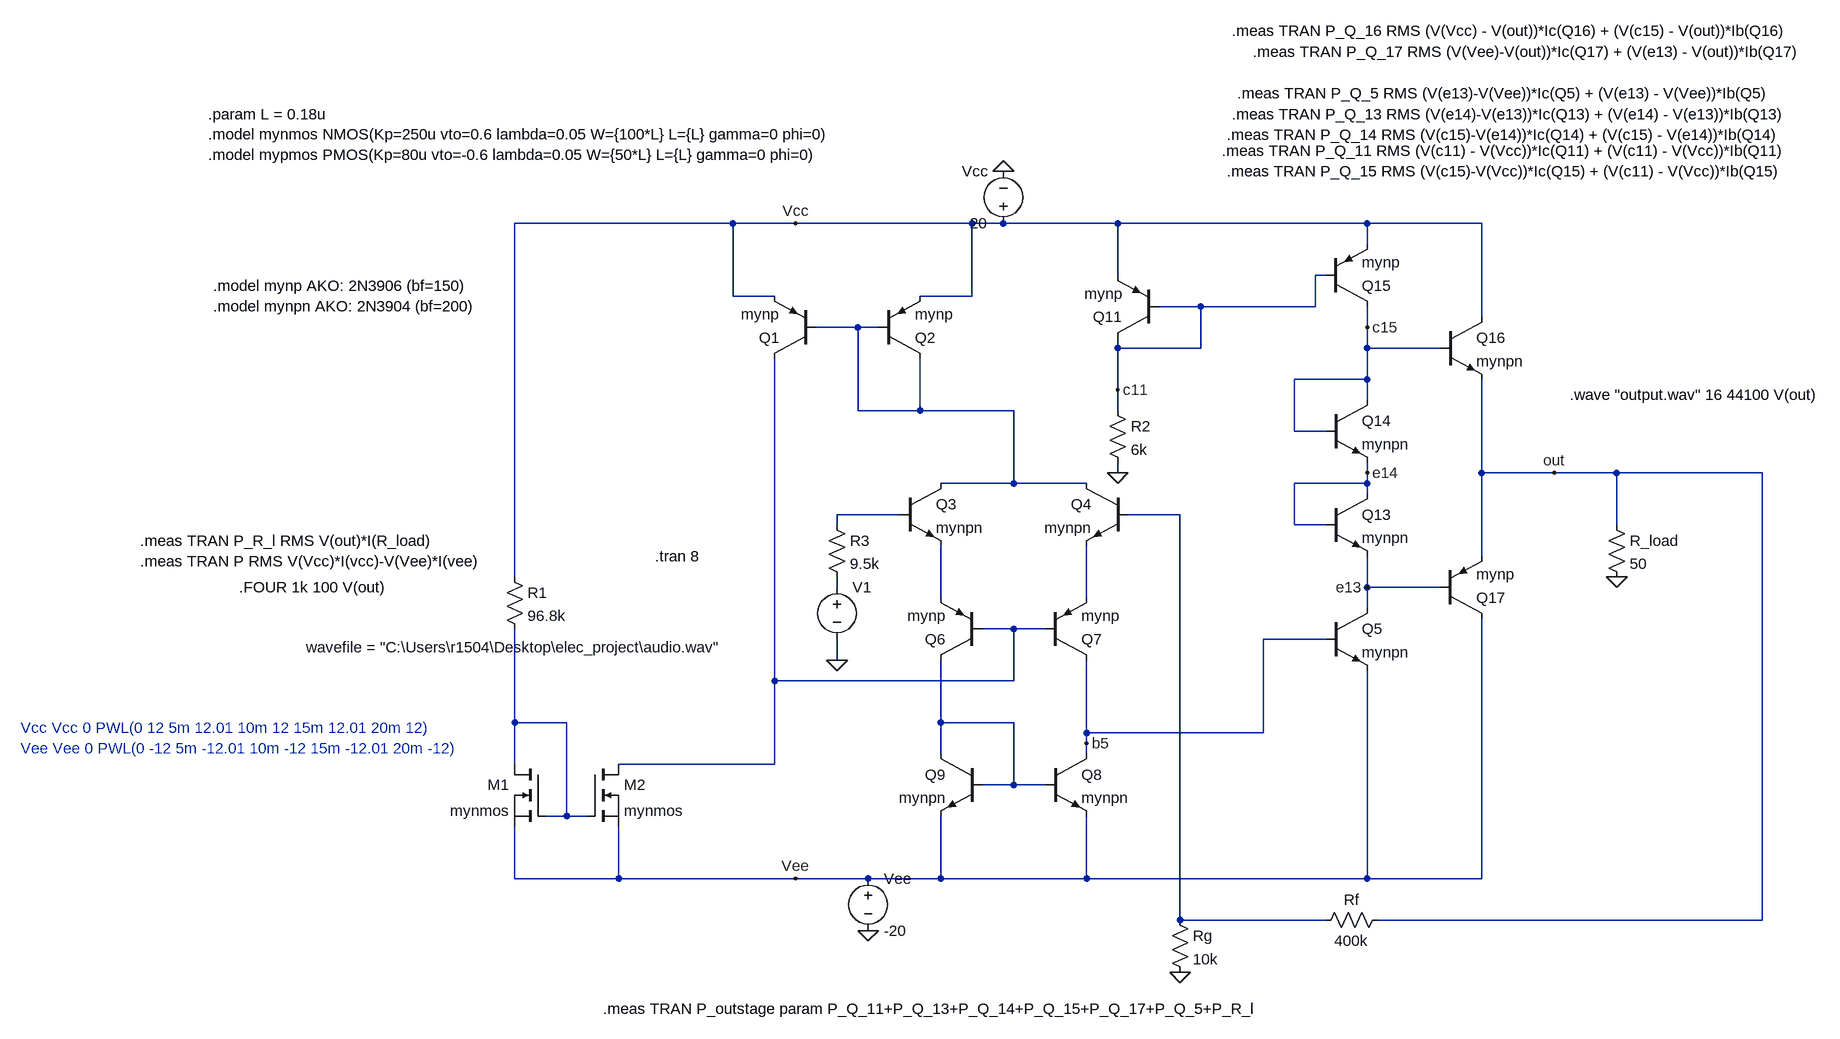
[diagram p0: schematic Electronics2_project.asc]
Electronics2_project.asc, the LTspice schematic file:
Version 4
SHEET 1 1956 980
WIRE -64 -320 -400 -320
WIRE 32 -320 -64 -320
WIRE 304 -320 32 -320
WIRE 352 -320 304 -320
WIRE 528 -320 352 -320
WIRE 912 -320 528 -320
WIRE 1088 -320 912 -320
WIRE 912 -288 912 -320
WIRE 528 -240 528 -320
WIRE 848 -240 832 -240
WIRE -64 -208 -64 -320
WIRE 0 -208 -64 -208
WIRE 304 -208 304 -320
WIRE 304 -208 224 -208
WIRE 656 -192 592 -192
WIRE 832 -192 832 -240
WIRE 832 -192 656 -192
WIRE 1088 -176 1088 -320
WIRE 128 -160 64 -160
WIRE 160 -160 128 -160
WIRE 912 -160 912 -192
WIRE 528 -128 528 -144
WIRE 656 -128 656 -192
WIRE 656 -128 528 -128
WIRE 912 -128 912 -160
WIRE 1024 -128 912 -128
WIRE 912 -80 912 -128
WIRE 912 -80 800 -80
WIRE 528 -64 528 -128
WIRE 912 -48 912 -80
WIRE 128 -32 128 -160
WIRE 224 -32 224 -112
WIRE 224 -32 128 -32
WIRE 368 -32 224 -32
WIRE 528 -32 528 -64
WIRE 800 0 800 -80
WIRE 848 0 800 0
WIRE 528 64 528 48
WIRE 912 64 912 48
WIRE 1088 64 1088 -80
WIRE 1200 64 1088 64
WIRE 1296 64 1200 64
WIRE 1520 64 1296 64
WIRE 368 80 368 -32
WIRE 368 80 256 80
WIRE 480 80 368 80
WIRE 912 80 912 64
WIRE 912 80 800 80
WIRE 912 96 912 80
WIRE 192 128 96 128
WIRE 624 128 544 128
WIRE 96 144 96 128
WIRE 800 144 800 80
WIRE 848 144 800 144
WIRE 1296 144 1296 64
WIRE 1088 192 1088 64
WIRE -400 224 -400 -320
WIRE 96 240 96 224
WIRE 912 240 912 192
WIRE 1024 240 912 240
WIRE 256 256 256 176
WIRE 480 256 480 176
WIRE 912 272 912 240
WIRE 368 304 320 304
WIRE 416 304 368 304
WIRE 848 320 752 320
WIRE 96 352 96 320
WIRE 0 384 0 -112
WIRE 368 384 368 304
WIRE 368 384 0 384
WIRE -400 448 -400 304
WIRE -320 448 -400 448
WIRE 256 448 256 352
WIRE 368 448 256 448
WIRE 480 464 480 352
WIRE 752 464 752 320
WIRE 752 464 480 464
WIRE 480 480 480 464
WIRE 256 496 256 448
WIRE 480 496 480 480
WIRE -400 512 -400 448
WIRE 0 512 0 384
WIRE 0 512 -240 512
WIRE 368 544 368 448
WIRE 368 544 320 544
WIRE 416 544 368 544
WIRE -320 592 -320 448
WIRE -320 592 -352 592
WIRE -288 592 -320 592
WIRE -400 688 -400 608
WIRE -240 688 -240 608
WIRE -240 688 -400 688
WIRE 32 688 -240 688
WIRE 144 688 32 688
WIRE 256 688 256 592
WIRE 256 688 144 688
WIRE 480 688 480 592
WIRE 480 688 256 688
WIRE 912 688 912 368
WIRE 912 688 480 688
WIRE 1088 688 1088 288
WIRE 1088 688 912 688
WIRE 624 752 624 128
WIRE 848 752 624 752
WIRE 1520 752 1520 64
WIRE 1520 752 928 752
FLAG 96 352 0
FLAG 528 64 0
FLAG 1200 64 out
FLAG 32 688 Vee
FLAG 32 -320 Vcc
FLAG 624 832 0
FLAG 912 -160 c15
FLAG 912 64 e14
FLAG 912 240 e13
FLAG 480 480 b5
FLAG 528 -64 c11
FLAG 1296 224 0
FLAG 352 -400 0
FLAG 144 768 0
SYMBOL nmos -352 512 M0
SYMATTR InstName M1
SYMATTR Value mynmos
SYMBOL nmos -288 512 R0
SYMATTR InstName M2
SYMATTR Value mynmos
SYMBOL res -416 208 R0
SYMATTR InstName R1
SYMATTR Value 96.8k
SYMBOL pnp 64 -112 R180
SYMATTR InstName Q1
SYMATTR Value mynp
SYMBOL pnp 160 -112 M180
SYMATTR InstName Q2
SYMATTR Value mynp
SYMBOL npn 192 80 R0
SYMATTR InstName Q3
SYMATTR Value mynpn
SYMBOL npn 544 80 M0
SYMATTR InstName Q4
SYMATTR Value mynpn
SYMBOL npn 848 272 R0
SYMATTR InstName Q5
SYMATTR Value mynpn
SYMBOL pnp 320 352 R180
SYMATTR InstName Q6
SYMATTR Value mynp
SYMBOL pnp 416 352 M180
SYMATTR InstName Q7
SYMATTR Value mynp
SYMBOL npn 416 496 R0
SYMATTR InstName Q8
SYMATTR Value mynpn
SYMBOL npn 320 496 M0
SYMATTR InstName Q9
SYMATTR Value mynpn
SYMBOL pnp 592 -144 R180
SYMATTR InstName Q11
SYMATTR Value mynp
SYMBOL npn 848 96 R0
SYMATTR InstName Q13
SYMATTR Value mynpn
SYMBOL npn 848 -48 R0
SYMATTR InstName Q14
SYMATTR Value mynpn
SYMBOL pnp 848 -192 M180
SYMATTR InstName Q15
SYMATTR Value mynp
SYMBOL npn 1024 -176 R0
SYMATTR InstName Q16
SYMATTR Value mynpn
SYMBOL pnp 1024 288 M180
SYMATTR InstName Q17
SYMATTR Value mynp
SYMBOL res 512 -48 R0
SYMATTR InstName R2
SYMATTR Value 6k
SYMBOL res 80 128 R0
SYMATTR InstName R3
SYMATTR Value 9.5k
SYMBOL res 608 736 R0
SYMATTR InstName Rg
SYMATTR Value 10k
SYMBOL res 944 736 R90
WINDOW 0 0 56 VBottom 2
WINDOW 3 32 56 VTop 2
SYMATTR InstName Rf
SYMATTR Value 400k
SYMBOL res 1280 128 R0
SYMATTR InstName R_load
SYMATTR Value 50
SYMBOL voltage 96 224 R0
WINDOW 3 -817 108 Left 2
SYMATTR Value wavefile = "C:\Users\r1504\Desktop\elec_project\audio.wav"
SYMATTR InstName V1
SYMBOL voltage 352 -304 R180
WINDOW 0 24 96 Left 2
WINDOW 3 24 16 Left 2
WINDOW 123 0 0 Left 0
WINDOW 39 0 0 Left 0
SYMATTR InstName Vcc
SYMATTR Value 20
SYMBOL voltage 144 672 R0
WINDOW 123 0 0 Left 0
WINDOW 39 0 0 Left 0
SYMATTR InstName Vee
SYMATTR Value -20
TEXT -872 -488 Left 2 !.param L = 0.18u\n.model mynmos NMOS(Kp=250u vto=0.6 lambda=0.05 W={100*L} L={L} gamma=0 phi=0)\n.model mypmos PMOS(Kp=80u vto=-0.6 lambda=0.05 W={50*L} L={L} gamma=0 phi=0)
TEXT -864 -224 Left 2 !.model mynp AKO: 2N3906 (bf=150)\n.model mynpn AKO: 2N3904 (bf=200)
TEXT -976 168 Left 2 !.meas TRAN P_R_l RMS V(out)*I(R_load)
TEXT -976 200 Left 2 !.meas TRAN P RMS V(Vcc)*I(vcc)-V(Vee)*I(vee)
TEXT -824 240 Left 2 !.FOUR 1k 100 V(out)
TEXT 688 -432 Left 2 !.meas TRAN P_Q_11 RMS (V(c11) - V(Vcc))*Ic(Q11) + (V(c11) - V(Vcc))*Ib(Q11)
TEXT 696 -400 Left 2 !.meas TRAN P_Q_15 RMS (V(c15)-V(Vcc))*Ic(Q15) + (V(c11) - V(Vcc))*Ib(Q15)
TEXT 696 -456 Left 2 !.meas TRAN P_Q_14 RMS (V(c15)-V(e14))*Ic(Q14) + (V(c15) - V(e14))*Ib(Q14)
TEXT 704 -488 Left 2 !.meas TRAN P_Q_13 RMS (V(e14)-V(e13))*Ic(Q13) + (V(e14) - V(e13))*Ib(Q13)
TEXT 712 -520 Left 2 !.meas TRAN P_Q_5 RMS (V(e13)-V(Vee))*Ic(Q5) + (V(e13) - V(Vee))*Ib(Q5)
TEXT 736 -584 Left 2 !.meas TRAN P_Q_17 RMS (V(Vee)-V(out))*Ic(Q17) + (V(e13) - V(out))*Ib(Q17)
TEXT -264 888 Left 2 !.meas TRAN P_outstage param P_Q_11+P_Q_13+P_Q_14+P_Q_15+P_Q_17+P_Q_5+P_R_l
TEXT 704 -616 Left 2 !.meas TRAN P_Q_16 RMS (V(Vcc) - V(out))*Ic(Q16) + (V(c15) - V(out))*Ib(Q16)
TEXT -184 192 Left 2 !.tran 8
TEXT 1224 -56 Left 2 !.wave "output.wav" 16 44100 V(out)
TEXT -1160 456 Left 2 ;Vcc Vcc 0 PWL(0 12 5m 12.01 10m 12 15m 12.01 20m 12)\nVee Vee 0 PWL(0 -12 5m -12.01 10m -12 15m -12.01 20m -12)

The netlist it stands for:
* Electronics2_project.asc
M1 N008 N008 Vee Vee mynmos
M2 N007 N008 Vee Vee mynmos
R1 Vcc N008 96.8k
Q1 N007 N001 Vcc 0 mynp
Q2 N001 N001 Vcc 0 mynp
Q3 N001 N002 N005 0 mynpn
Q4 N001 N003 N006 0 mynpn
Q5 e13 b5 Vee 0 mynpn
Q6 N009 N007 N005 0 mynp
Q7 b5 N007 N006 0 mynp
Q8 b5 N009 Vee 0 mynpn
Q9 N009 N009 Vee 0 mynpn
Q11 c11 c11 Vcc 0 mynp
Q13 e14 e14 e13 0 mynpn
Q14 c15 c15 e14 0 mynpn
Q15 c15 c11 Vcc 0 mynp
Q16 Vcc c15 out 0 mynpn
Q17 Vee e13 out 0 mynp
R2 c11 0 6k
R3 N002 N004 9.5k
Rg N003 0 10k
Rf out N003 400k
R_load out 0 50
V1 N004 0 wavefile = "C:\Users\r1504\Desktop\elec_project\audio.wav"
Vcc Vcc 0 20
Vee Vee 0 -20
.model NPN NPN
.model PNP PNP
.lib standard.bjt
.model NMOS NMOS
.model PMOS PMOS
.lib standard.mos
.param L = 0.18u
.model mynmos NMOS(Kp=250u vto=0.6 lambda=0.05 W={100*L} L={L} gamma=0 phi=0)
.model mypmos PMOS(Kp=80u vto=-0.6 lambda=0.05 W={50*L} L={L} gamma=0 phi=0)
.model mynp AKO: 2N3906 (bf=150)
.model mynpn AKO: 2N3904 (bf=200)
.meas TRAN P_R_l RMS V(out)*I(R_load)
.meas TRAN P RMS V(Vcc)*I(vcc)-V(Vee)*I(vee)
.FOUR 1k 100 V(out)
.meas TRAN P_Q_11 RMS (V(c11) - V(Vcc))*Ic(Q11) + (V(c11) - V(Vcc))*Ib(Q11)
.meas TRAN P_Q_15 RMS (V(c15)-V(Vcc))*Ic(Q15) + (V(c11) - V(Vcc))*Ib(Q15)
.meas TRAN P_Q_14 RMS (V(c15)-V(e14))*Ic(Q14) + (V(c15) - V(e14))*Ib(Q14)
.meas TRAN P_Q_13 RMS (V(e14)-V(e13))*Ic(Q13) + (V(e14) - V(e13))*Ib(Q13)
.meas TRAN P_Q_5 RMS (V(e13)-V(Vee))*Ic(Q5) + (V(e13) - V(Vee))*Ib(Q5)
.meas TRAN P_Q_17 RMS (V(Vee)-V(out))*Ic(Q17) + (V(e13) - V(out))*Ib(Q17)
.meas TRAN P_outstage param P_Q_11+P_Q_13+P_Q_14+P_Q_15+P_Q_17+P_Q_5+P_R_l
.meas TRAN P_Q_16 RMS (V(Vcc) - V(out))*Ic(Q16) + (V(c15) - V(out))*Ib(Q16)
.tran 8
.wave "output.wav" 16 44100 V(out)
* Vcc Vcc 0 PWL(0 12 5m 12.01 10m 12 15m 12.01 20m 12)
* Vee Vee 0 PWL(0 -12 5m -12.01 10m -12 15m -12.01 20m -12)
.backanno
.end